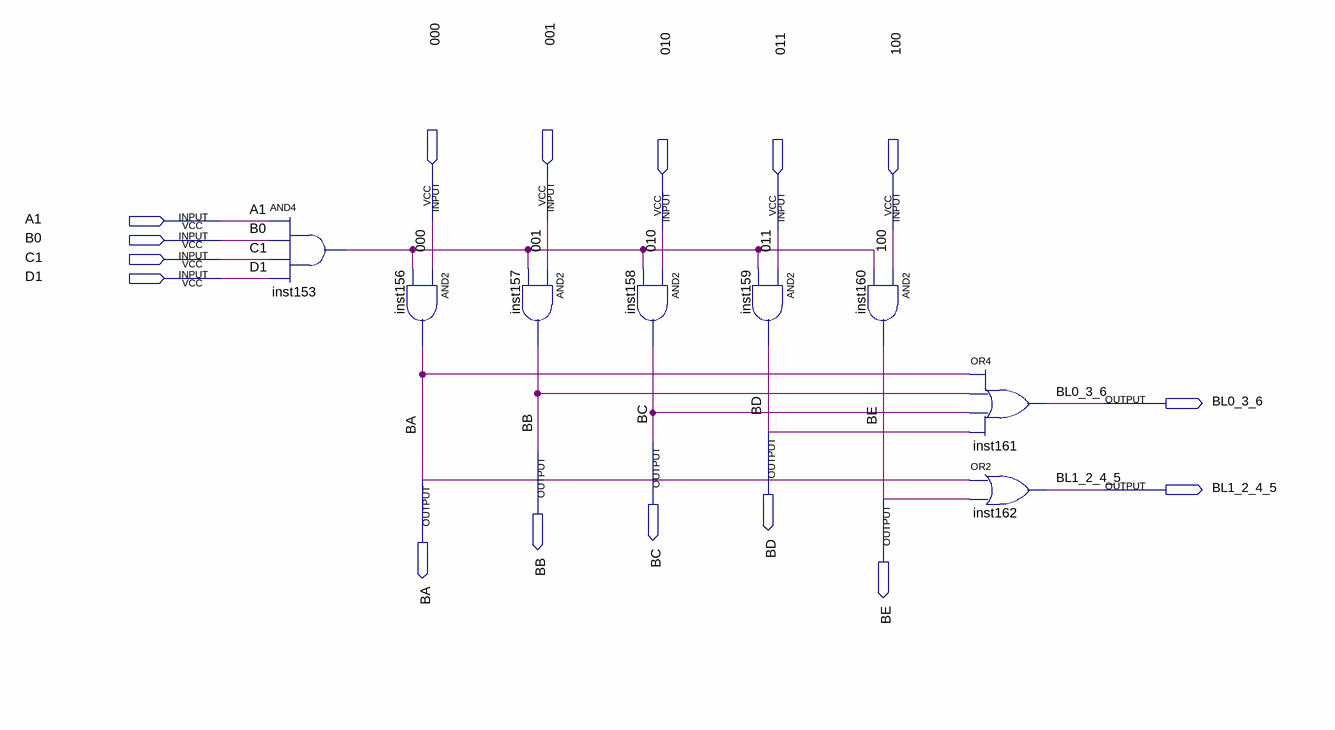
[diagram p0: schematic sheet]
// Quartus schematic caracB.bdf as structural Verilog: 8 symbols, 16 pins
module caracB (
  input  A1,
  input  \000 ,
  input  \001 ,
  input  \010 ,
  input  \011 ,
  input  \100 ,
  input  B0,
  input  C1,
  input  D1,
  output BL0_3_6,
  output BD,
  output BC,
  output BB,
  output BA,
  output BL1_2_4_5,
  output BE
);

  wire inst153_out;

  and inst153 (inst153_out, A1, B0, C1, D1);
  and inst156 (BA, \000 , inst153_out);
  and inst157 (BB, \001 , inst153_out);
  and inst158 (BC, \010 , inst153_out);
  and inst159 (BD, \011 , inst153_out);
  and inst160 (BE, \100 , inst153_out);
  or inst161 (BL0_3_6, BA, BB, BC, BD);
  or inst162 (BL1_2_4_5, BA, BE);
endmodule
